# EasyEDA Pro project CircuitSupply_v1_0_3.eprj

# Schematic Schematic1
Board Name: Board1; Create Date: 2025-06-01; Page Name: P1; Project Name: CircuitSupply; Schematic Name: Schematic1; Update Date: 2025-06-01; Company: 嘉立创EDA; Drawed: 王大智; Page Size: A4; Version: V1.0
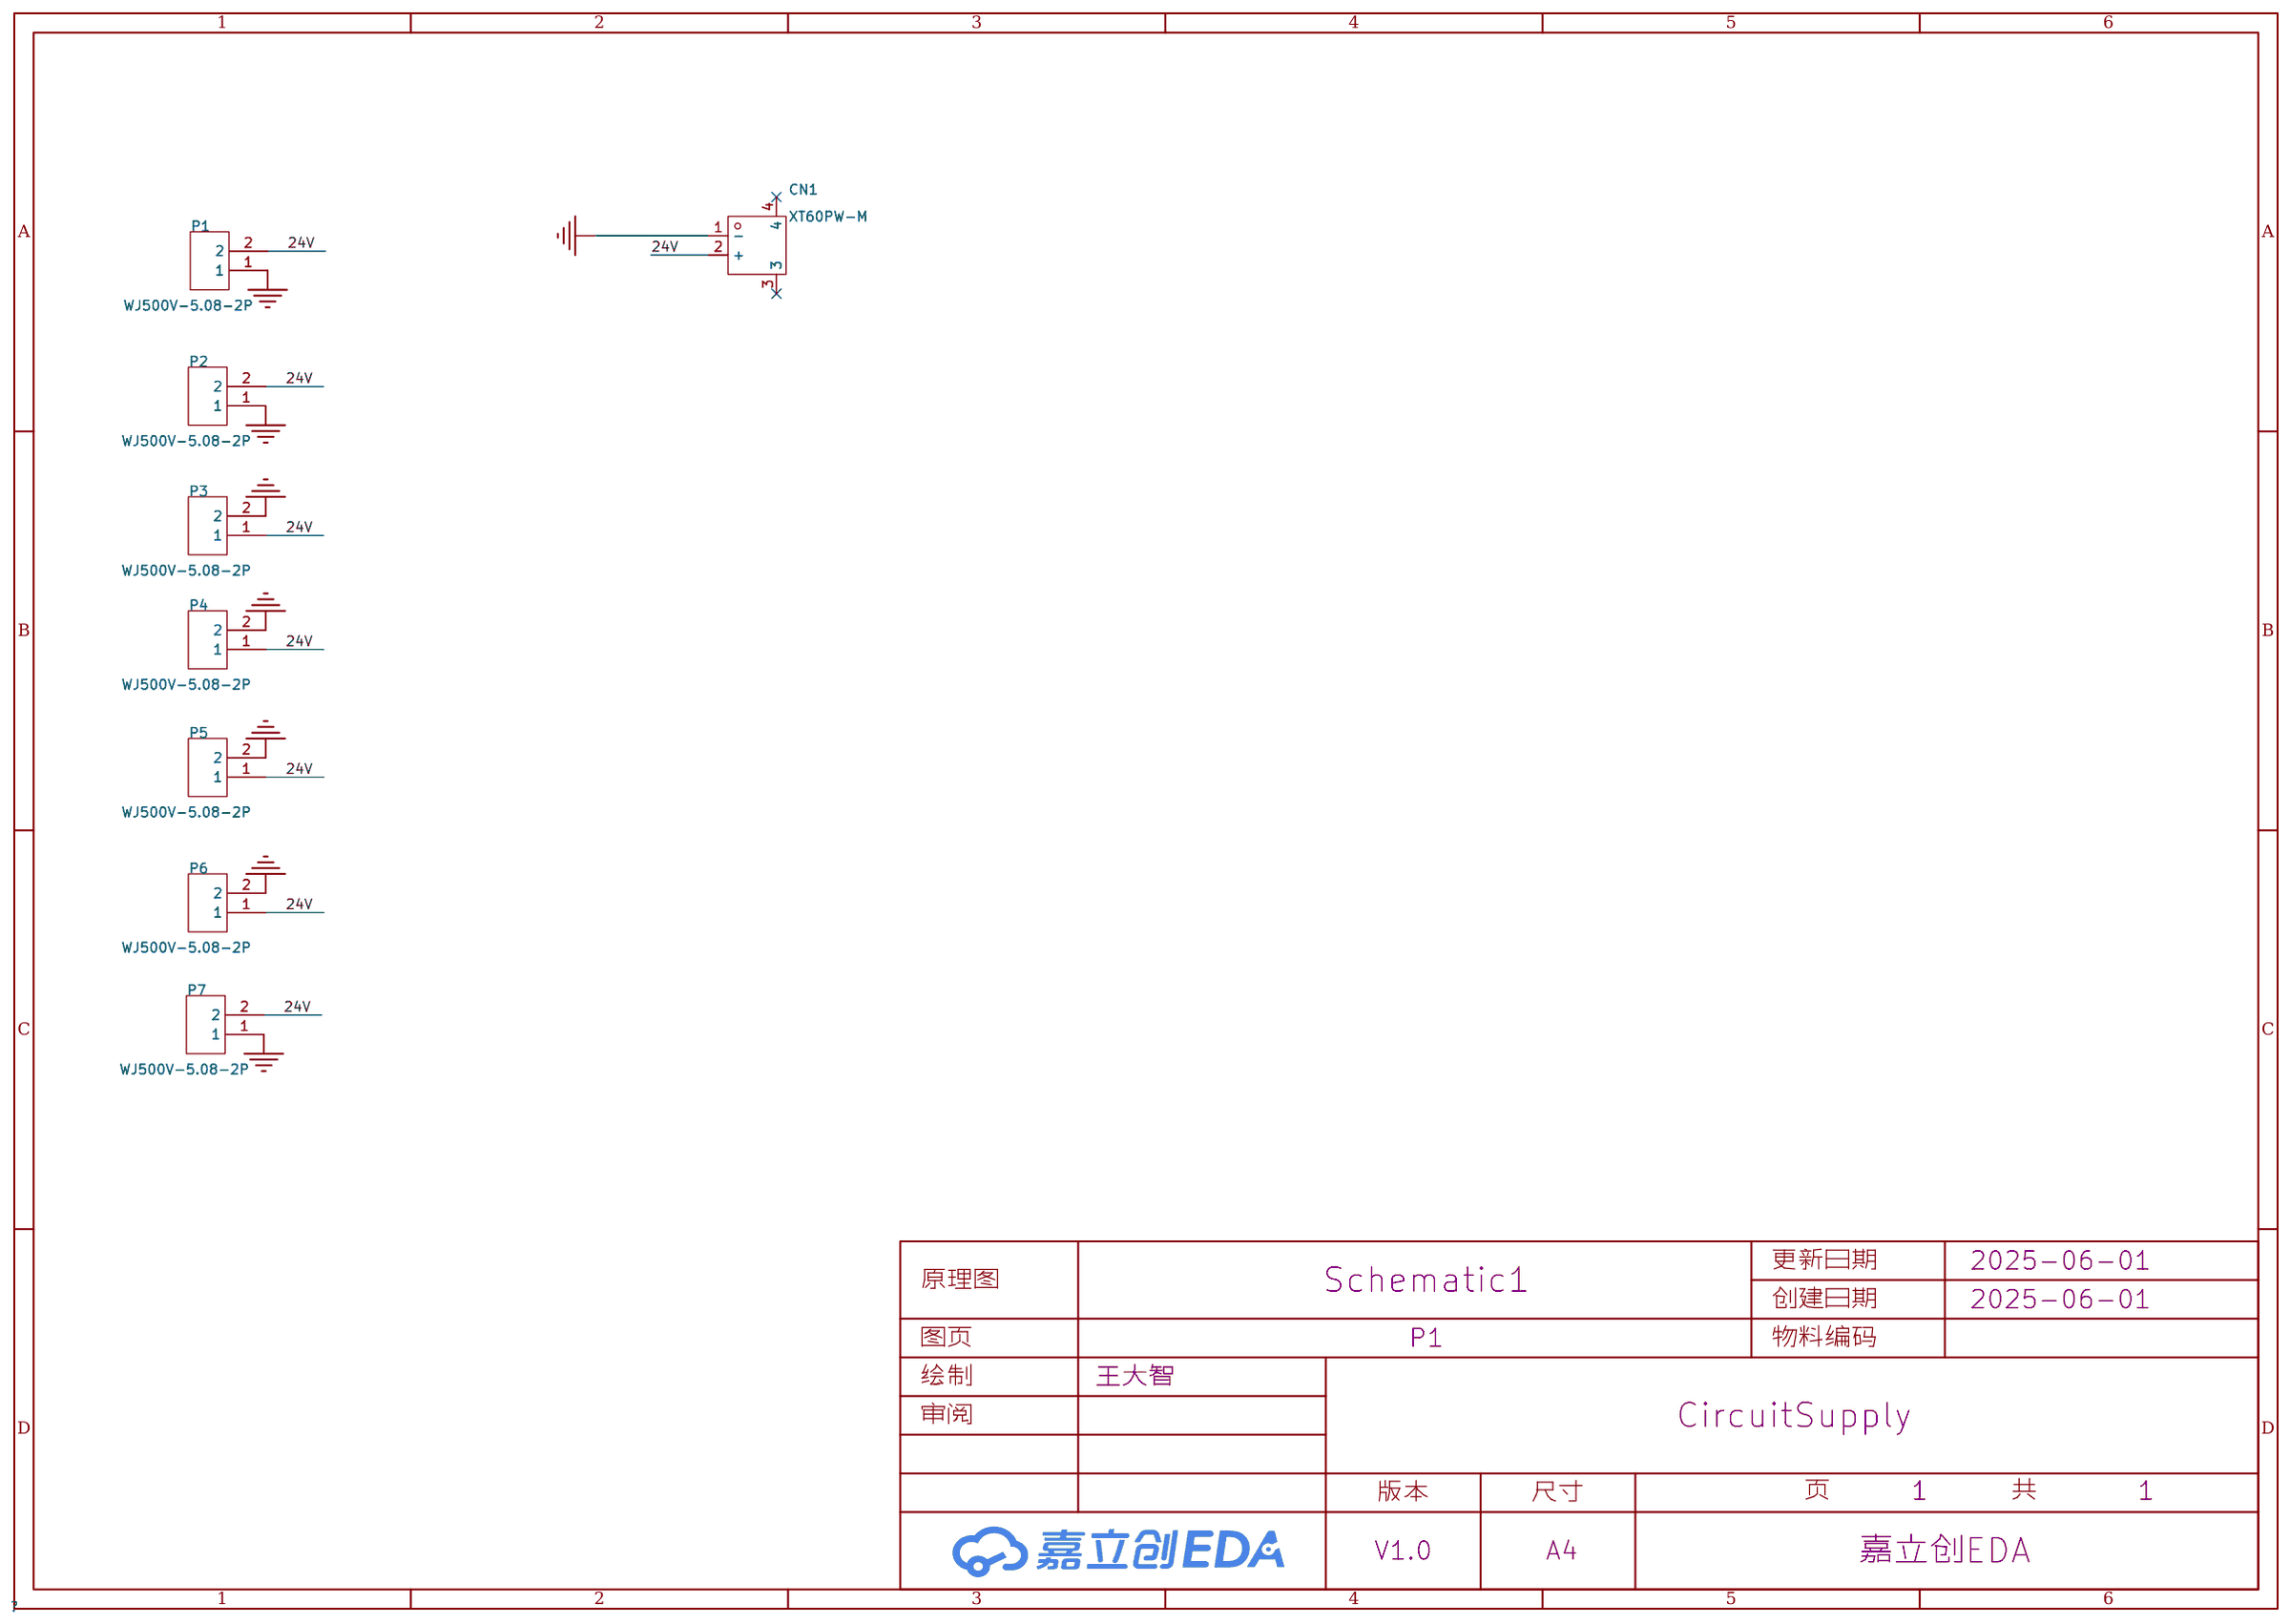
[diagram p0: schematic sheet]

## Parts
CN1  XT60PW-M  [CONN-TH_XT60PW-M]
P1  WJ500V-5.08-2P  [CONN-TH_2P-P5.00_WJ500V-5.08-2P]
P2  WJ500V-5.08-2P  [CONN-TH_2P-P5.00_WJ500V-5.08-2P]
P3  WJ500V-5.08-2P  [CONN-TH_2P-P5.00_WJ500V-5.08-2P]
P4  WJ500V-5.08-2P  [CONN-TH_2P-P5.00_WJ500V-5.08-2P]
P5  WJ500V-5.08-2P  [CONN-TH_2P-P5.00_WJ500V-5.08-2P]
P6  WJ500V-5.08-2P  [CONN-TH_2P-P5.00_WJ500V-5.08-2P]
P7  WJ500V-5.08-2P  [CONN-TH_2P-P5.00_WJ500V-5.08-2P]

## Library data of the parts
CN1 = XT60PW-M: 类别:-;类型1:-;; LCSC Part Name: AMASS(艾迈斯)航模插头xt60连接器150公母对接pw锂电池公头 板插卧式XT60PW-M; Supplier Part: C98732; Manufacturer: AMASS(艾迈斯); JLCPCB Part Class: 扩展库; Datasheet: https://atta.szlcsc.com/upload/public/pdf/source/20240118/44A3DCFF53BE25DC65378AFFB21277A4.pdf; Supplier: LCSC; Type: 卧式插头; Colour: 黄色; InterfaceType: 公头
P1-P7 = WJ500V-5.08-2P: 结构:1x2P;间距:5.08mm;颜色:绿色;安装方式:直插;额定电流:18A;额定电压:250V;排数:1;线规 - AWG:14~30;线规 - 平方毫米:2.5;每排PIN数:2;触头材质:-;触头镀层:-;工作温度范围:-40℃~+105℃;焊接温度(最大值):-;; LCSC Part Name: 1x2P 5.08mm 直插 排数:1 每排P数:2; Supplier Part: C8465; Manufacturer: KANGNEX(康奈克斯电气); Supplier Footprint: 插件,P=5.08mm; JLCPCB Part Class: 扩展库; Datasheet: https://atta.szlcsc.com/upload/public/pdf/source/20191225/C8465_02D34CE5B5B4A53DF5891601D97FA9F4.pdf; Supplier: LCSC; Structure: 1x2P; Pitch: 5.08mm; Color: 绿色; Mounting Style: 直插; Current Rating (Max): 18A; Voltage Rating (Max): 250V; Number of Pins: 2P; Number of Rows: 1; Wire Gauge - AWG: 14~30; Wire Gauge - mm2: 2.5; Number of PINs Per Row: 2; Operating Temperature Range: -40℃~+105℃; Screw Specification: M2.5

## Nets
24V: CN1.2(+) P1.2 P2.2 P3.1 P4.1 P5.1 P6.1 P7.2
GND: CN1.1(-) P1.1 P2.1 P3.2 P4.2 P5.2 P6.2 P7.1

Not connected (* = marked no-connect by the designer): CN1 3* 4*

# Board PCB1
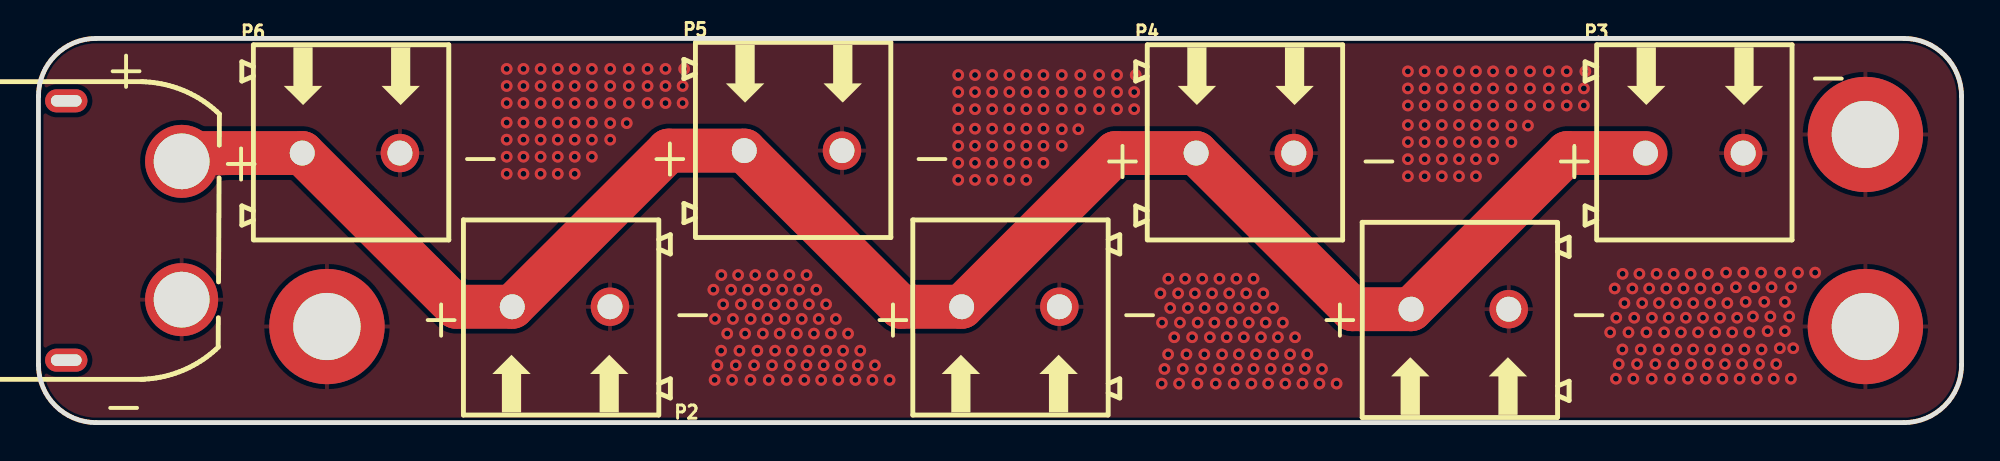
[diagram p1: board, top side]
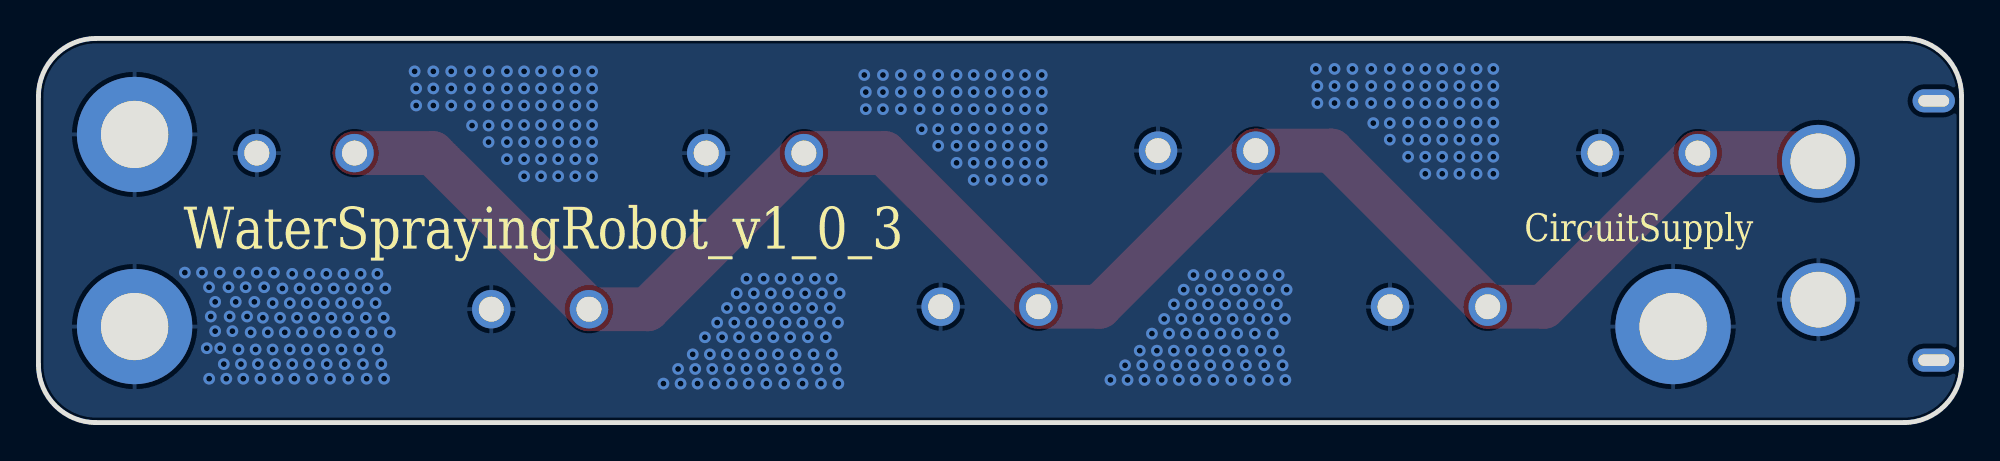
[diagram p2: board, bottom side, seen from below]

Outline 100 x 20 mm; copper layers: Top Layer, Bottom Layer. Coordinates in mm from the lower left corner of the outline.
Outline path: 0,17 0,3 arc(0.88,0.88) 3,0 97,0 arc(99.12,0.88) 100,3 100,17 arc(99.12,19.12) 97,20 3,20 arc(0.88,19.12) 0,17
Stack: Top Layer 0.035mm / Dielectric1 1.51mm FR4 er 4.5 / Bottom Layer 0.035mm

## Design rules (mm)
template: JLCPCB Capability(Two Layers Board)
spacing copperThickness1oz (default): track to track 0.102, other pairs 0.152 to 0.3
spacing copperThickness2oz: track to track 0.203, other pairs 0.152 to 0.3
track width copperThickness1oz (default): min 0.127, default 0.254, max 2.54
track width copperThickness2oz: min 0.203, default 0.254, max 2.54
differential pair differentialPair (default): width min 0.127, default 0.254, max 2.54; gap min 0.152, default 0.152
via viaSize (default): diameter min 0.5, default 0.61, max 10; hole min 0.3, default 0.305, max 6.3

## Placement (name value [footprint] x y rotation side)
CN1  XT60PW-M  [CONN-TH_XT60PW-M]  4.44 10 0 top
NOREF  -  [Pad_e12]  95 15 0 top
NOREF#2  -  [Pad_e13]  95 5 0 top
NOREF#3  -  [Pad_e10]  15 5 0 top
P1  WJ500V-5.08-2P  [CONN-TH_2P-P5.00_WJ500V-5.08-2P]  50.55 6.03 180 top
P2  WJ500V-5.08-2P  [CONN-TH_2P-P5.00_WJ500V-5.08-2P]  27.18 6.03 180 top
P3  WJ500V-5.08-2P  [CONN-TH_2P-P5.00_WJ500V-5.08-2P]  86.11 14.03 0 top
P4  WJ500V-5.08-2P  [CONN-TH_2P-P5.00_WJ500V-5.08-2P]  62.74 14.03 0 top
P5  WJ500V-5.08-2P  [CONN-TH_2P-P5.00_WJ500V-5.08-2P]  39.24 14.16 0 top
P6  WJ500V-5.08-2P  [CONN-TH_2P-P5.00_WJ500V-5.08-2P]  16.26 14.03 0 top
P7  WJ500V-5.08-2P  [CONN-TH_2P-P5.00_WJ500V-5.08-2P]  73.91 5.9 180 top

## Footprints (pads in the part's own frame, mm; a bottom-side part is the same pattern mirrored in y, then rotated)
CONN-TH_2P-P5.00_WJ500V-5.08-2P
  round 2 hole 1.3: 1(-2.54,0) 2(2.54,0)
CONN-TH_XT60PW-M
  round 3.8 hole 2.9: 1(3,-3.6) 2(3,3.6)
  oval 2.2x1.2 hole 1.6x0.6: 3(-3,6.75) 4(-3,-6.75)
Pad_e10
  round 6 hole 3.5: 1(0,0)
Pad_e12
  round 6 hole 3.5: 1(0,0)
Pad_e13
  round 6 hole 3.5: 1(0,0)

## Nets
24V: CN1.2 P1.2 P2.2 P3.1 P4.1 P5.1 P6.1 P7.2
GND: CN1.1 NOREF.1 NOREF#2.1 NOREF#3.1 P1.1 P2.1 P3.2 P4.2 P5.2 P6.2 P7.1

Pads without a net: CN1 3 4

## Via types
v1: diameter 0.61, hole 0.305, Top Layer to Bottom Layer, 396 vias

## Routing (per net, layer and track width the routed paths; a pad name or vN(x,y) marks a point on that pad's centre or on a via; arc(x,y) is an arc through that point)
24V: length 96.4
  Top Layer w2.286: P3.1 79.5,14.03 P7.2 68.33,5.9 P4.1 56.01,14.03 P1.2 44.83,6.03 P5.1 32.77,14.16 P2.2 21.72,6.03 P6.1 7.88,14.03 CN1.2
GND:
  vias: v1(24.35,18.41) v1(24.35,17.52) v1(24.35,16.63) v1(24.35,15.62) v1(24.35,14.73) v1(24.35,13.84) v1(24.35,12.95) v1(25.22,18.41) v1(25.22,17.52) v1(25.22,16.63) v1(25.22,15.62) v1(25.22,14.73) v1(25.22,13.84) v1(25.22,12.95) v1(26.11,18.41) v1(26.11,17.52) v1(26.11,16.63) v1(26.11,15.62) v1(26.11,14.73) v1(26.11,13.84) v1(26.11,12.95) v1(27,18.41) v1(27,17.52) v1(27,16.63) v1(27,15.62) v1(27,14.73) v1(27,13.84) v1(27,12.95) v1(27.89,18.41) v1(27.89,17.52) v1(27.89,16.63) v1(27.89,15.62) v1(27.89,14.73) v1(27.89,13.84) v1(27.89,12.95) v1(28.78,18.41) v1(28.78,17.52) v1(28.78,16.63) v1(28.78,15.62) v1(28.78,14.73) v1(28.78,13.84) v1(29.73,18.41) v1(29.73,17.52) v1(29.73,16.63) v1(29.73,15.59) v1(29.73,14.73) v1(30.59,15.59) v1(30.7,18.41) v1(30.7,17.52) v1(30.7,16.63) v1(31.67,18.41) v1(31.67,17.52) v1(31.67,16.63) v1(32.6,18.41) v1(32.6,17.52) v1(32.6,16.63) v1(33.5,17.52) v1(33.5,16.63) v1(33.58,18.41) v1(35.1,6.92) v1(35.18,5.39) v1(35.16,2.22) v1(35.31,2.98) v1(35.51,7.68) v1(35.5,3.74) v1(35.6,6.16) v1(35.82,4.63) v1(36.02,6.92) v1(36.11,5.39) v1(36.07,2.22) v1(36.26,2.98) v1(36.38,7.68) v1(36.53,6.16) v1(36.45,3.74) v1(36.75,4.63) v1(36.89,6.92) v1(37.03,5.39) v1(37.02,2.22) v1(37.21,2.98) v1(37.27,7.68) v1(37.4,6.16) v1(37.38,3.74) v1(37.67,4.63) v1(37.78,6.92) v1(37.91,5.39) v1(37.97,2.22) v1(38.14,2.98) v1(38.17,7.68) v1(38.29,6.16) v1(38.3,3.74) v1(38.54,4.63) v1(38.67,6.92) v1(38.8,5.39) v1(38.91,2.22) v1(39.05,7.68) v1(39.07,2.98) v1(39.18,6.16) v1(39.18,3.74) v1(39.43,4.63) v1(39.56,6.92) v1(39.69,5.39) v1(39.83,2.22) v1(39.94,7.68) v1(39.94,2.98) v1(40.06,6.16) v1(40.07,3.74) v1(40.32,4.63) v1(40.45,6.92) v1(40.57,5.39) v1(40.7,2.22) v1(40.83,2.98) v1(40.96,6.16) v1(40.96,3.74) v1(41.21,4.63) v1(41.46,5.39) v1(41.59,2.22) v1(41.72,2.98) v1(41.84,3.74) v1(42.1,4.63) v1(42.48,2.22) v1(42.6,2.98) v1(42.73,3.74) v1(43.37,2.22) v1(43.5,2.98) v1(44.26,2.22) v1(47.83,18.09) v1(47.83,17.21) v1(47.83,16.32) v1(47.83,15.3) v1(47.83,14.41) v1(47.83,13.52) v1(47.83,12.63) v1(48.7,18.09) v1(48.7,17.21) v1(48.7,16.32) v1(48.7,15.3) v1(48.7,14.41) v1(48.7,13.52) v1(48.7,12.63) v1(49.59,18.09) v1(49.59,17.21) v1(49.59,16.32) v1(49.59,15.3) v1(49.59,14.41) v1(49.59,13.52) v1(49.59,12.63) v1(50.49,18.09) v1(50.49,17.21) v1(50.49,16.32) v1(50.49,15.3) v1(50.49,14.41) v1(50.49,13.52) v1(50.49,12.63) v1(51.37,18.09) v1(51.37,17.21) v1(51.37,16.32) v1(51.37,15.3) v1(51.37,14.41) v1(51.37,13.52) v1(51.37,12.63) v1(52.26,18.09) v1(52.26,17.21) v1(52.26,16.32) v1(52.26,15.3) v1(52.26,14.41) v1(52.26,13.52) v1(53.21,18.09) v1(53.21,17.21) v1(53.21,16.32) v1(53.21,15.27) v1(53.21,14.41) v1(54.07,15.27) v1(54.18,18.09) v1(54.18,17.21) v1(54.18,16.32) v1(55.16,18.09) v1(55.16,17.21) v1(55.16,16.32) v1(56.09,18.09) v1(56.09,17.21) v1(56.09,16.32) v1(56.98,17.21) v1(56.98,16.32) v1(57.06,18.09) v1(58.34,6.73) v1(58.43,5.2) v1(58.41,2.03) v1(58.55,2.79) v1(58.74,3.55) v1(58.75,7.49) v1(58.85,5.97) v1(59.06,4.44) v1(59.26,6.73) v1(59.31,2.03) v1(59.36,5.2) v1(59.5,2.79) v1(59.63,7.49) v1(59.69,3.55) v1(59.77,5.97) v1(59.99,4.44) v1(60.13,6.73) v1(60.28,5.2) v1(60.27,2.03) v1(60.52,7.49) v1(60.46,2.79) v1(60.64,5.97) v1(60.63,3.55) v1(60.91,4.44) v1(61.03,6.73) v1(61.15,5.2) v1(61.22,2.03) v1(61.41,7.49) v1(61.39,2.79) v1(61.53,5.97) v1(61.55,3.55) v1(61.79,4.44) v1(61.92,6.73) v1(62.04,5.2) v1(62.15,2.03) v1(62.29,7.49) v1(62.31,2.79) v1(62.43,5.97) v1(62.42,3.55) v1(62.68,4.44) v1(62.8,6.73) v1(62.93,5.2) v1(63.07,2.03) v1(63.18,7.49) v1(63.18,2.79) v1(63.31,5.97) v1(63.31,3.55) v1(63.57,4.44) v1(63.69,6.73) v1(63.82,5.2) v1(63.94,2.03) v1(64.07,2.79) v1(64.2,5.97) v1(64.2,3.55) v1(64.45,4.44) v1(64.71,5.2) v1(64.84,2.03) v1(64.97,2.79) v1(65.09,3.55) v1(65.34,4.44) v1(65.73,2.03) v1(65.85,2.79) v1(65.98,3.55) v1(66.61,2.03) v1(66.74,2.79) v1(67.5,2.03) v1(71.21,18.29) v1(71.21,17.4) v1(71.21,16.51) v1(71.21,15.49) v1(71.21,14.6) v1(71.21,13.71) v1(71.21,12.82) v1(72.08,18.29) v1(72.08,17.4) v1(72.08,16.51) v1(72.08,15.49) v1(72.08,14.6) v1(72.08,13.71) v1(72.08,12.82) v1(72.97,18.29) v1(72.97,17.4) v1(72.97,16.51) v1(72.97,15.49) v1(72.97,14.6) v1(72.97,13.71) v1(72.97,12.82) v1(73.87,18.29) v1(73.87,17.4) v1(73.87,16.51) v1(73.87,15.49) v1(73.87,14.6) v1(73.87,13.71) v1(73.87,12.82) v1(74.75,18.29) v1(74.75,17.4) v1(74.75,16.51) v1(74.75,15.49) v1(74.75,14.6) v1(74.75,13.71) v1(74.75,12.82) v1(75.64,18.29) v1(75.64,17.4) v1(75.64,16.51) v1(75.64,15.49) v1(75.64,14.6) v1(75.64,13.71) v1(76.59,18.29) v1(76.59,17.4) v1(76.59,16.51) v1(76.59,15.46) v1(76.59,14.6) v1(77.45,15.46) v1(77.56,18.29) v1(77.56,17.4) v1(77.56,16.51) v1(78.54,18.29) v1(78.54,17.4) v1(78.54,16.51) v1(79.47,18.29) v1(79.47,17.4) v1(79.47,16.51) v1(80.44,18.29) v1(80.36,17.4) v1(80.36,16.51) v1(81.73,4.7) v1(81.96,6.98) v1(82.05,5.46) v1(82.03,2.28) v1(82.17,3.05) v1(82.38,7.74) v1(82.36,3.81) v1(82.47,6.22) v1(82.68,4.7) v1(82.88,6.98) v1(82.93,2.28) v1(82.98,5.46) v1(83.13,3.05) v1(83.25,7.74) v1(83.32,3.81) v1(83.39,6.22) v1(83.61,4.7) v1(83.76,6.98) v1(83.9,5.46) v1(83.89,2.28) v1(84.14,7.74) v1(84.08,3.05) v1(84.25,3.81) v1(84.26,6.22) v1(84.53,4.7) v1(84.65,6.98) v1(84.77,5.46) v1(84.84,2.28) v1(85.03,7.74) v1(85.01,3.05) v1(85.16,6.22) v1(85.17,3.81) v1(85.41,4.7) v1(85.54,6.98) v1(85.66,5.46) v1(85.77,2.28) v1(85.91,7.74) v1(85.93,3.05) v1(86.05,6.22) v1(86.04,3.81) v1(86.3,4.7) v1(86.42,6.98) v1(86.56,5.46) v1(86.69,2.28) v1(86.81,7.74) v1(86.8,3.05) v1(86.93,6.22) v1(86.93,3.81) v1(87.19,4.7) v1(87.31,6.98) v1(87.44,5.46) v1(87.57,2.28) v1(87.7,3.05) v1(87.76,7.81) v1(87.82,6.22) v1(87.83,3.81) v1(88.07,4.7) v1(88.26,7.05) v1(88.33,5.46) v1(88.46,2.28) v1(88.59,3.05) v1(88.65,7.81) v1(88.71,3.81) v1(88.77,6.28) v1(88.97,4.7) v1(89.23,7.05) v1(89.15,5.52) v1(89.35,2.28) v1(89.47,3.05) v1(89.57,7.81) v1(89.6,3.81) v1(89.74,6.28) v1(89.92,4.76) v1(90.12,7.05) v1(90.06,5.52) v1(90.23,2.28) v1(90.36,3.05) v1(90.57,7.81) v1(90.55,3.87) v1(90.81,6.28) v1(90.81,4.76) v1(91.04,5.52) v1(91.13,7.05) v1(91.12,2.28) v1(91.25,3.87) v1(91.5,7.81) v1(92.39,7.81)

## Copper pours and planes (outline as drawn; the poured copper is in the pictures)
GND on Top Layer: -18.92,24.83 107.06,24.83 107.06,-6.67 -18.92,-6.67
GND on Bottom Layer: -14.99,27.75 107.44,27.75 107.44,-8.7 -14.99,-8.7

Small or netless copper shapes (teardrops, artwork), in the pictures only: 1 on Top Layer

## Text on the board
Bottom Silkscreen Layer: CircuitSupply | WaterSprayingRobot_v1_0_3
Top Silkscreen Layer: - | +
